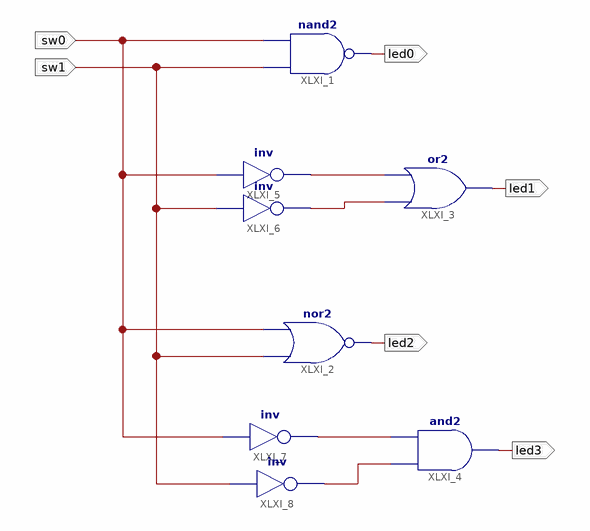
[diagram p0: schematic sheet 1]
// Xilinx ISE schematic tema3_2a.sch (spartan3e) as structural Verilog: 8 symbols, 6 ports
module tema3_2a (
  input  sw0,
  input  sw1,
  output led0,
  output led1,
  output led2,
  output led3
);

  wire XLXN_1, XLXN_2, XLXN_4, XLXN_5;

  nand XLXI_1 (led0, sw1, sw0);
  nor XLXI_2 (led2, sw1, sw0);
  or XLXI_3 (led1, XLXN_2, XLXN_1);
  and XLXI_4 (led3, XLXN_5, XLXN_4);
  not XLXI_5 (XLXN_1, sw0);
  not XLXI_6 (XLXN_2, sw1);
  not XLXI_7 (XLXN_4, sw0);
  not XLXI_8 (XLXN_5, sw1);
endmodule
